# EAGLE design cfide-adapter (EAGLE 7.5.0)
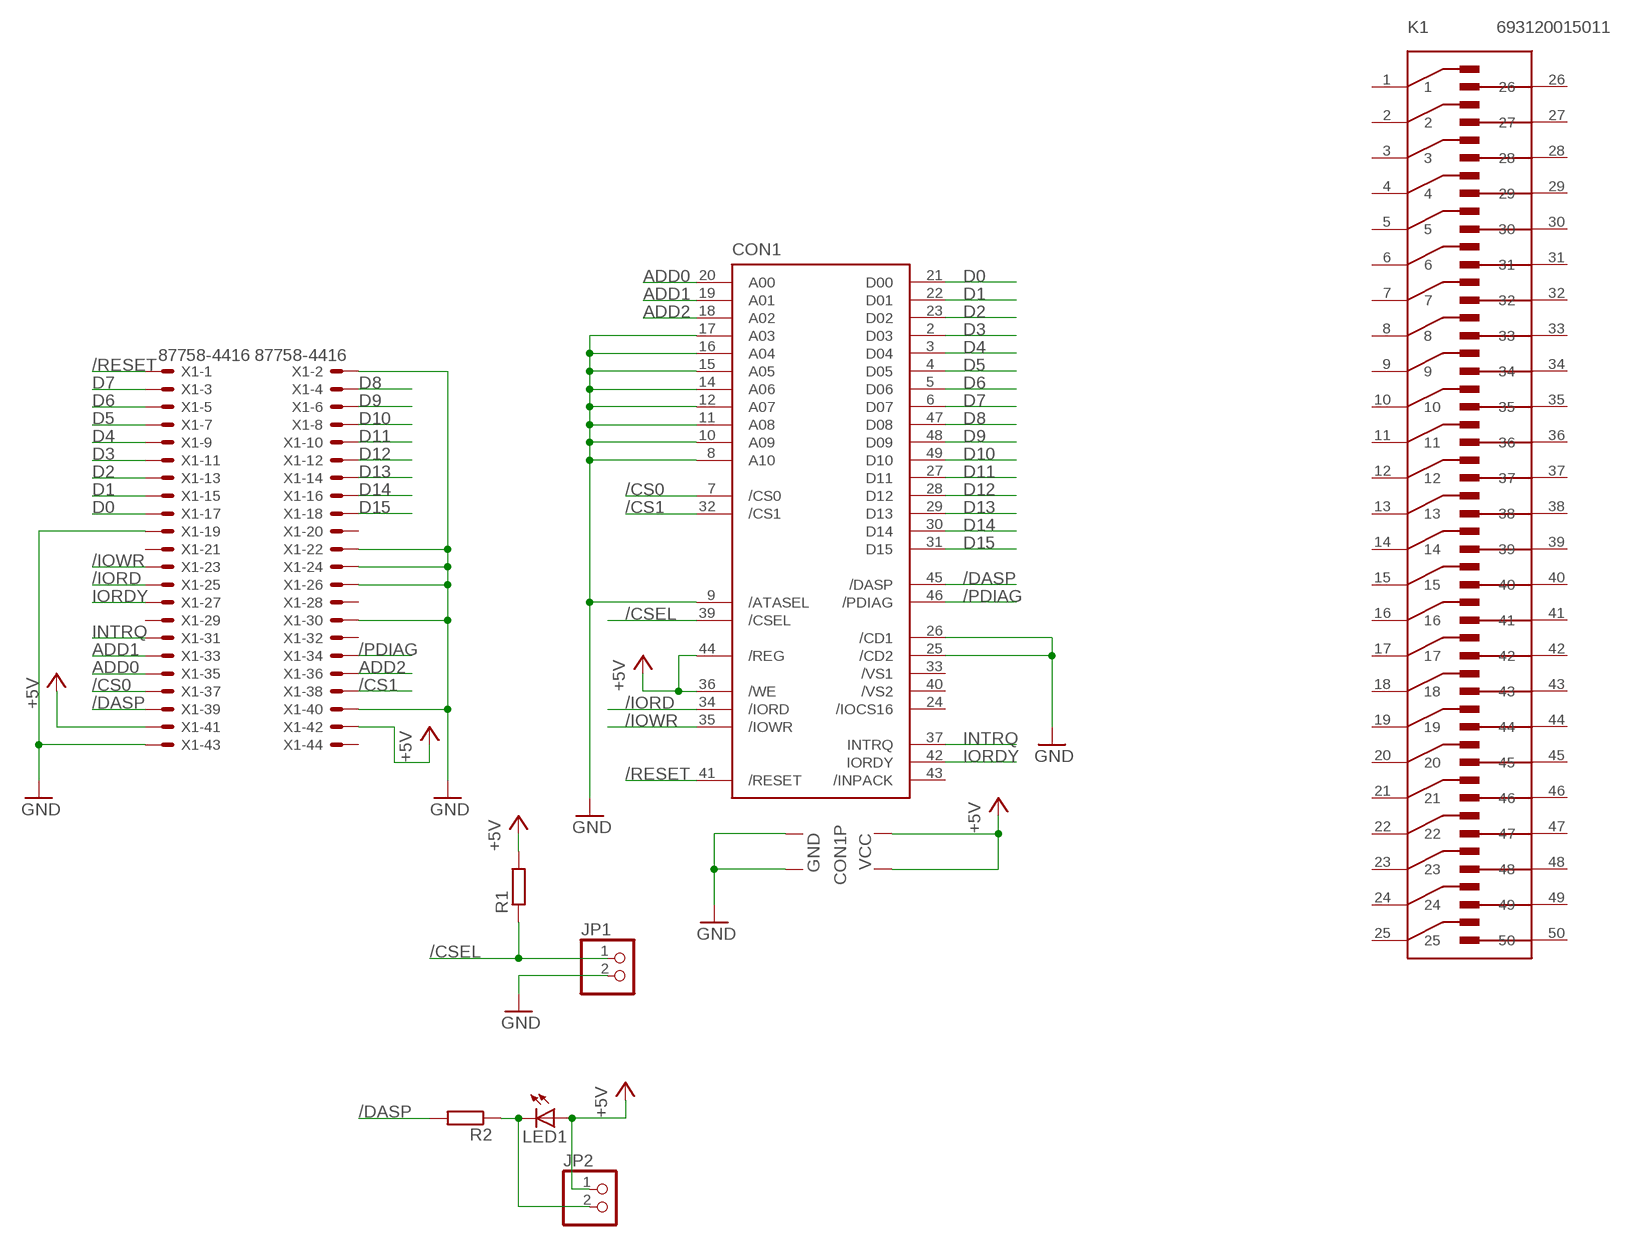
[diagram p0: schematic, sheet 1]

## Parts
CON1  CF-CARD-IDE_MODE  [MI20-50PD-SF]
JP1  HEADER-1X2ROUND  [1X02_ROUND]
JP2  HEADER-1X2ROUND  [1X02_ROUND]
K1  693120015011  [693120015011]
LED1  LEDCHIP-LED0603  [CHIP-LED0603]
R1  R-EU_R0603  [R0603]
R2  R-EU_R0603  [R0603]
X1  87758-4416  [87758-4416]

## Nets
+5V: CON1.13(VCC2) CON1.36(/WE) CON1.38(VCC1) CON1.44(/REG) JP2.1 LED1.A R1.2 X1.41 X1.42
/CS0: CON1.7(/CS0) X1.37
/CS1: CON1.32(/CS1) X1.38
/CSEL: CON1.39(/CSEL) JP1.1 R1.1
/DASP: CON1.45(/DASP) R2.2 X1.39
/IORD: CON1.34(/IORD) X1.25
/IOWR: CON1.35(/IOWR) X1.23
/PDIAG: CON1.46(/PDIAG) X1.34
/RESET: CON1.41(/RESET) X1.1
ADD0: CON1.20(A00) X1.35
ADD1: CON1.19(A01) X1.33
ADD2: CON1.18(A02) X1.36
D0: CON1.21(D00) X1.17
D1: CON1.22(D01) X1.15
D2: CON1.23(D02) X1.13
D3: CON1.2(D03) X1.11
D4: CON1.3(D04) X1.9
D5: CON1.4(D05) X1.7
D6: CON1.5(D06) X1.5
D7: CON1.6(D07) X1.3
D8: CON1.47(D08) X1.4
D9: CON1.48(D09) X1.6
D10: CON1.49(D10) X1.8
D11: CON1.27(D11) X1.10
D12: CON1.28(D12) X1.12
D13: CON1.29(D13) X1.14
D14: CON1.30(D14) X1.16
D15: CON1.31(D15) X1.18
GND: CON1.1(GND1) CON1.8(A10) CON1.9(/ATASEL) CON1.10(A09) CON1.11(A08) CON1.12(A07) CON1.14(A06) CON1.15(A05) CON1.16(A04) CON1.17(A03) CON1.25(/CD2) CON1.26(/CD1) CON1.50(GND2) JP1.2 X1.2 X1.19 X1.22 X1.24 X1.26 X1.30 X1.40 X1.43
INTRQ: CON1.37(INTRQ) X1.31
IORDY: CON1.42(IORDY) X1.27
N$3: JP2.2 LED1.C R2.1
Unconnected: CON1.24(/IOCS16) CON1.33(/VS1) CON1.40(/VS2) CON1.43(/INPACK) K1.1 K1.2 K1.3 K1.4 K1.5 K1.6 K1.7 K1.8 K1.9 K1.10 K1.11 K1.12 K1.13 K1.14 K1.15 K1.16 K1.17 K1.18 K1.19 K1.20 K1.21 K1.22 K1.23 K1.24 K1.25 K1.26 K1.27 K1.28 K1.29 K1.30 K1.31 K1.32 K1.33 K1.34 K1.35 K1.36 K1.37 K1.38 K1.39 K1.40 K1.41 K1.42 K1.43 K1.44 K1.45 K1.46 K1.47 K1.48 K1.49 K1.50 X1.20 X1.21 X1.28 X1.29 X1.32 X1.44

## Library data of the parts
CON1 = con-hirose:CF-CARD-IDE_MODE: Compact Flash Adapter Type I or II without Eject Button Source: con-hirose.lbr from Bob Starr <rtzaudio@mindspring.com>; OC_FARNELL: unknown; OC_NEWARK: unknown
JP1 JP2 = microbuilder:HEADER-1X2: PIN HEADER
K1 = Wuerth_Elektronik_eiCan_Communication_Connectors_v2.2:693120015011: WR-CRD COMPACT FLASH CARD CONNECTOR HEADER 50PINS
LED1 = adafruit:LED: LED OSRAM: - CHIPLED LG R971, LG N971, LY N971, LG Q971, LY Q971, LO R971, LY R971 LH N974, LH R974 LS Q976, LO Q976, LY Q976 LO Q996 - Hyper CHIPLED LW Q18S LB Q993, LB Q99A, LB R99A - SideLED LS A670, LO A670, LY A670, LG A670, LP A670 LB A673, LV A673, LT A673, LW A673 LH A674 LY A675 LS A676, LA A676, LO A676, LY A676, LW A676 LS A679, LY A679, LG A679 - Hyper Micro SIDELED® LS Y876, LA Y876, LO Y876, LY Y876 LT Y87S - SmartLED LW L88C, LW L88S LB L89C, LB L89S, LG L890 LS L89K, LO L89K, LY L89K LS L896, LA L896, LO L896, LY L896 - TOPLED LS T670, LO T670, LY T670, LG T670, LP T670 LSG T670, LSP T670, LSY T670, LOP T670, LYG T670 LG T671, LOG T671, LSG T671 LB T673, LV T673, LT T673, LW T673 LH T674 LS T676, LA T676, LO T676, LY T676, LB T676, LH T676, LSB T676, LW T676 LB T67C, LV T67C, LT T67C, LS T67K, LO T67K, LY T67K, LW E67C LS E67B, LA E67B, LO E67B, LY E67B, LB E67C, LV E67C, LT E67C LW T67C LS T679, LY T679, LG T679 LS T770, LO T770, LY T770, LG T770, LP T770 LB T773, LV T773, LT T773, LW T773 LH T774 LS E675, LA E675, LY E675, LS T675 LS T776, LA T776, LO T776, LY T776, LB T776 LHGB T686 LT T68C, LB T68C - Hyper Mini TOPLED® LB M676 - Mini TOPLED Santana® LG M470 LS M47K, LO M47K, LY M47K Source: http://www.osram.convergy.de/
R1 R2 = resistor:R-EU_: RESISTOR, European symbol
X1 = con-molex:87758-4416: 44 Pin - 2mm Dual Row Single Wafer, Vertical T/H HDR Source: http://www.molex.com/pdm_docs/sd/877580616_sd.pdf; MF: MOLEX; MPN: 87758-4416; OC_FARNELL: unknown; OC_NEWARK: 59J1588

## Board
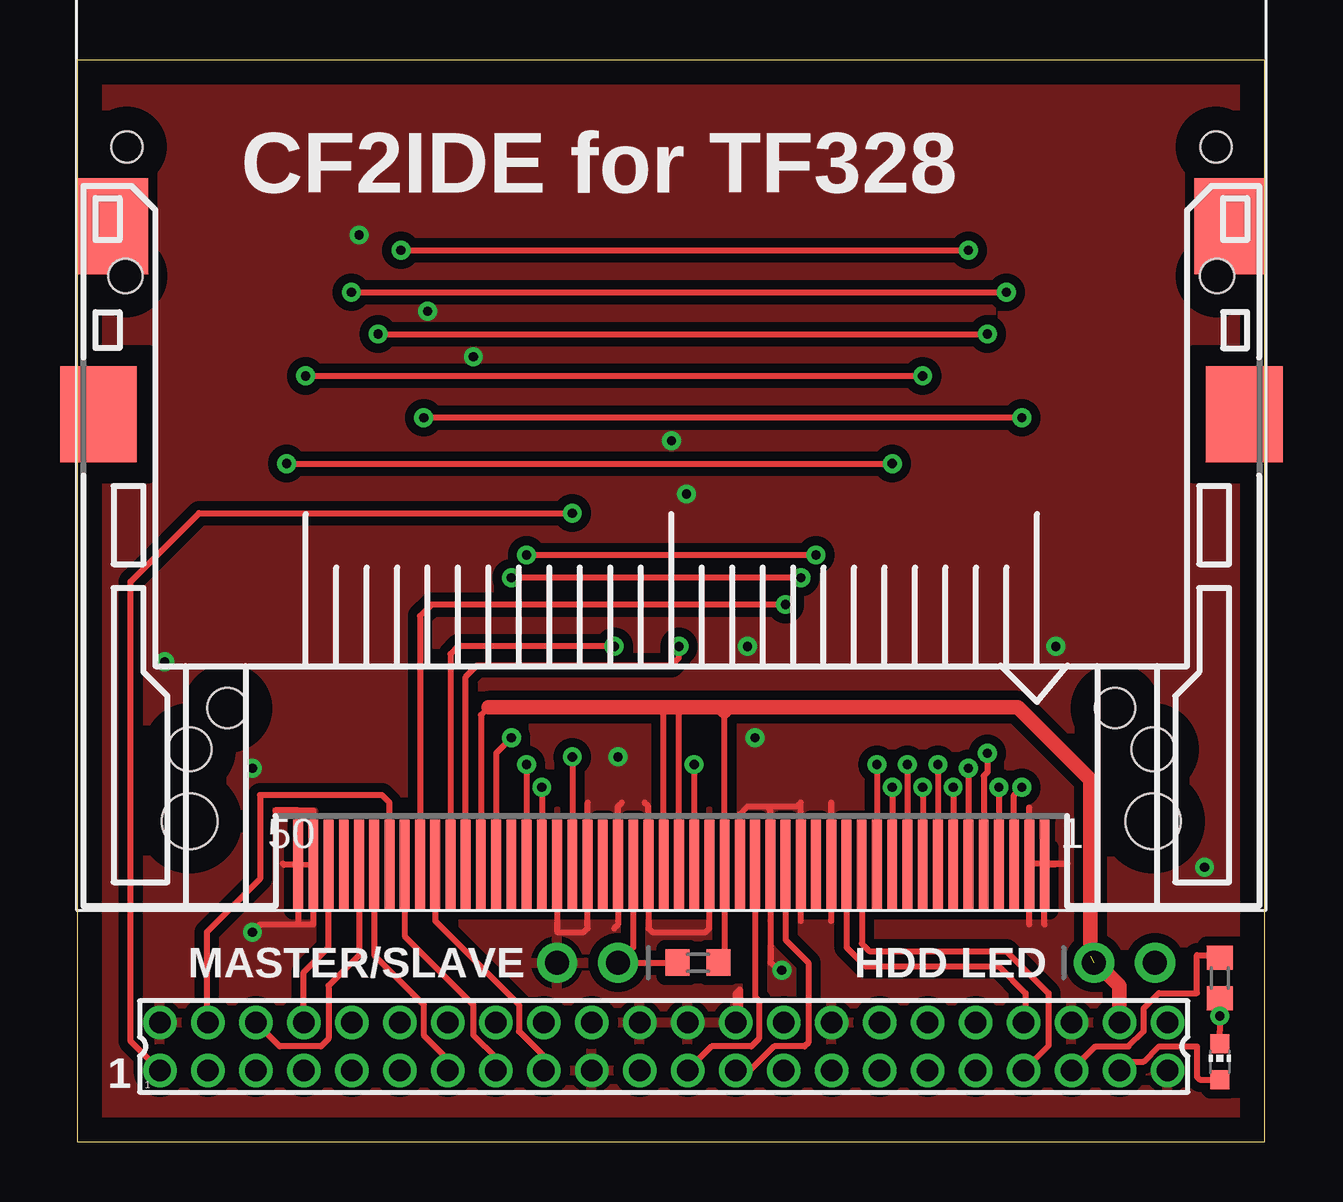
[diagram p1: board, top side]
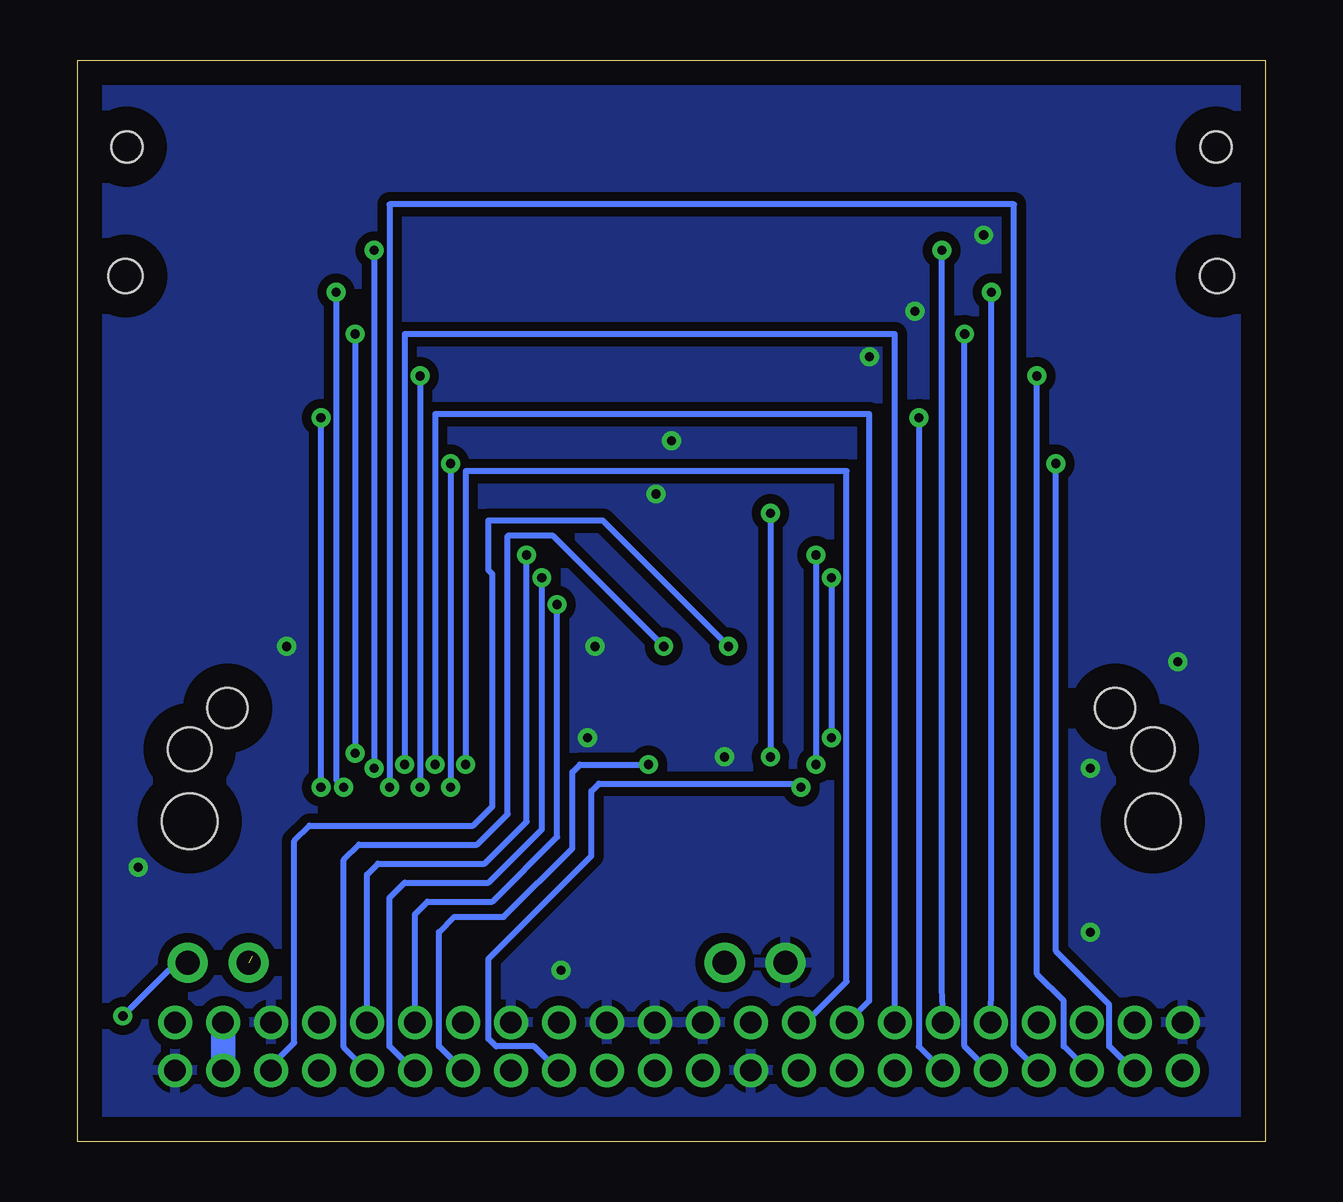
[diagram p2: board, bottom side, seen from below]

Size 49.51 x 45.07 mm. Coordinates in mm from the lower left corner, seen from the top.
Outline: 0,0 49.51,0 49.51,45.07 0,45.07 0,0
Copper layers (1*16): Top 0.035mm / dielectric 1.5mm / Bottom 0.035mm
Design rules "default": minimum track width 10mil, minimum drill 24mil, track to track 8mil, track to pad 8mil, pad to pad 8mil, via to via 8mil, smd to smd 8mil, copper to edge 40mil, drill to drill 8mil, minimum pad ring 10mil, minimum via ring 8mil, stop-mask expansion 4mil, vias tented up to drill 0mil, thermal gap 10mil

### Footprints (pad centres in the part's own frame; a part is rotated, then mirrored left to right if it is on the bottom)
MI20-50PD-SF = smd 0.41 x 3.75: 1 15.557,-18.78; 2 14.287,-18.78; 3 13.018,-18.78; 4 11.748,-18.78; 5 10.477,-18.78; 6 9.207,-18.78; 7 7.938,-18.78; 8 6.668,-18.78; 9 5.397,-18.78; 10 4.128,-18.78; 11 2.857,-18.78; 12 1.587,-18.78; 13 0.318,-18.78; 14 -0.953,-18.78; 15 -2.223,-18.78; 16 -3.493,-18.78; 17 -4.763,-18.78; 18 -6.032,-18.78; 19 -7.303,-18.78; 20 -8.572,-18.78; 21 -9.842,-18.78; 22 -11.113,-18.78; 23 -12.383,-18.78; 24 -13.652,-18.78; 25 -14.922,-18.78; 26 14.922,-18.78; 27 13.652,-18.78; 28 12.383,-18.78; 29 11.113,-18.78; 30 9.842,-18.78; 31 8.572,-18.78; 32 7.303,-18.78; 33 6.032,-18.78; 34 4.763,-18.78; 35 3.493,-18.78; 36 2.223,-18.78; 37 0.953,-18.78; 38 -0.318,-18.78; 39 -1.587,-18.78; 40 -2.857,-18.78; 41 -4.128,-18.78; 42 -5.397,-18.78; 43 -6.668,-18.78; 44 -7.938,-18.78; 45 -9.207,-18.78; 46 -10.477,-18.78; 47 -11.748,-18.78; 48 -13.018,-18.78; 49 -14.287,-18.78; 50 -15.557,-18.78 | smd 3.2 x 4: M1 -23.883,-0.005; M2 23.883,-0.005 | hole 1.676: 18.5,-12.25; -18.5,-12.25 | hole 1.422: -22.75,5.75; 22.75,5.75
1X02_ROUND = drill 1 pad 1.676: 1 -1.27,0; 2 1.27,0
693120015011 = smd 0.4 x 2.6: 1 15.875,0; 2 14.605,0; 3 13.335,0; 4 12.065,0; 5 10.795,0; 6 9.525,0; 7 8.255,0; 8 6.985,0; 9 5.715,0; 10 4.445,0; 11 3.175,0; 12 1.905,0; 13 0.635,0; 14 -0.635,0; 15 -1.905,0; 16 -3.175,0; 17 -4.445,0; 18 -5.715,0; 19 -6.985,0; 20 -8.255,0; 21 -9.525,0; 22 -10.795,0; 23 -12.065,0; 24 -13.335,0; 25 -14.605,0; 26 15.24,0; 27 13.97,0; 28 12.7,0; 29 11.43,0; 30 10.16,0; 31 8.89,0; 32 7.62,0; 33 6.35,0; 34 5.08,0; 35 3.81,0; 36 2.54,0; 37 1.27,0; 38 0,0; 39 -1.27,0; 40 -2.54,0; 41 -3.81,0; 42 -5.08,0; 43 -6.35,0; 44 -7.62,0; 45 -8.89,0; 46 -10.16,0; 47 -11.43,0; 48 -12.7,0; 49 -13.97,0; 50 -15.24,0 | smd 3 x 4: P$1 -22.98,27.2; P$2 23.615,27.2 | hole 2.3: -19.76,2.4; 20.395,2.4 | hole 1.8: -19.76,5.4; 20.395,5.4 | hole 1.3: -22.38,30.5; 23.015,30.5
CHIP-LED0603 = smd 0.8 x 0.8: A 0,-0.75; C 0,0.75
R0603 = smd 1 x 1.1: 1 -0.85,0; 2 0.85,0
87758-4416 = drill 0.9 pad 1.27: 1 -21,-1; 2 -21,1; 3 -19,-1; 4 -19,1; 5 -17,-1; 6 -17,1; 7 -15,-1; 8 -15,1; 9 -13,-1; 10 -13,1; 11 -11,-1; 12 -11,1; 13 -9,-1; 14 -9,1; 15 -7,-1; 16 -7,1; 17 -5,-1; 18 -5,1; 19 -3,-1; 20 -3,1; 21 -1,-1; 22 -1,1; 23 1,-1; 24 1,1; 25 3,-1; 26 3,1; 27 5,-1; 28 5,1; 29 7,-1; 30 7,1; 31 9,-1; 32 9,1; 33 11,-1; 34 11,1; 35 13,-1; 36 13,1; 37 15,-1; 38 15,1; 39 17,-1; 40 17,1; 41 19,-1; 42 19,1; 43 21,-1; 44 21,1

### Placement (x,y rotation side)
CON1  24.77,30.32 0 top
JP1  21.27,7.46 180 top
JP2  43.66,7.46 0 top
K1  24.45,10.95 0 top
LED1  47.62,3.33 0 top
R1  25.88,7.46 0 top
R2  47.62,6.83 90 top
X1  24.45,3.97 0 top

### Tracks (layer width: path | path; a pad name or v marks a point on that pad's centre or on a via)
+5V  (1 unrouted)
  Top 0.254: LED1.A 46.79,2.58 46.67,2.7 46.67,3.97 45.08,3.97 44.45,3.33 43.81,3.33 X1.41 | R1.2 26.99,7.56 CON1.36 26.99,17.94 27.15,18.1 | 17.14,18.1 16.83,17.78 CON1.44 | CON1.38 24.45,17.94 24.29,18.1 | CON1.13 25.08,18.1
  Top 0.61: X1.42 43.45,6.51 42.23,7.73 42.23,15.08 39.21,18.1 26.83,18.1 | 17.14,18.1 24.29,18.1 25.08,18.1 26.83,18.1 | 26.99,17.94 26.83,18.1
  Bottom 1.016: X1.42 X1.41
/CS0
  Top 0.254: CON1.7 32.7,8.25 33.02,7.94 38.73,7.94 40.48,6.19 40.48,4 X1.37
/CS1
  Top 0.254: CON1.32 32.07,8.1 32.86,7.3 38.42,7.3 39.53,6.19 39.53,5.05 X1.38
/CSEL
  Top 0.254: CON1.39 23.18,8.1 JP1.1 R1.1
/DASP  (via drill 0.38)
  Top 0.254: X1.39 42.45,3.97 43.81,3.97 44.45,4.6 44.45,5.56 45.08,6.19 46.67,6.19 46.67,7.78 47.52,7.78 R2.2 | v22.38,20.64 15.88,20.64 15.56,20.32 CON1.45
  Bottom 0.254: X1.39 41.45,3.16 40.48,4.13 40.48,12.54 39.85,13.18 33.02,13.18 32.23,13.97 32.23,23.65 32.38,23.81 32.38,25.88 27.62,25.88 v22.38,20.64
/IORD
  Top 0.254: CON1.34 29.53,8.41 30.48,7.46 30.48,4.13 30.32,3.97 29.05,3.97 28.05,2.97 X1.25
/IOWR
  Top 0.254: CON1.35 28.26,6.03 28.42,5.87 28.42,4.29 28.1,3.97 26.45,3.97 X1.23
/PDIAG  (via drill 0.38)
  Top 0.254: v29.53,22.38 14.76,22.38 14.29,21.91 CON1.46
  Bottom 0.254: X1.34 35.45,9.48 34.92,10 32.23,10 29.53,12.7 v29.53,22.38
/RESET  (via drill 0.38)
  Top 0.254: v20.64,26.19 5.08,26.19 2.22,23.34 2.22,4.19 X1.1 | v20.64,16.03 CON1.41
  Bottom 0.254: v20.64,26.19 v20.64,16.03
ADD0  (via drill 0.38)
  Top 0.254: CON1.20 16.19,19.37 16.67,19.84 24.77,19.84 25.08,20.16 v25.08,20.64
  Bottom 0.254: X1.35 38.42,3.94 38.42,11.75 37.78,12.38 32.86,12.38 31.59,13.65 31.59,25.24 29.69,25.24 v25.08,20.64
ADD1  (via drill 0.38)
  Top 0.254: v30.16,23.49 v18.1,23.49 | v18.1,16.83 17.46,16.19 CON1.19
  Bottom 0.254: X1.33 35.51,2.97 36.51,3.97 36.51,10.16 35.88,10.79 32.38,10.79 30.16,13.02 v30.16,23.49 | v18.1,23.49 v18.1,16.83
ADD2  (via drill 0.38)
  Top 0.254: v30.8,24.45 v18.73,24.45 | v18.73,15.72 CON1.18
  Bottom 0.254: X1.36 37.45,11.13 36.99,11.59 32.54,11.59 30.8,13.33 v30.8,24.45 | v18.73,24.45 v18.73,15.72
D0
  Top 0.254: CON1.21 14.92,9.21 18.41,5.71 18.41,4.6 19.53,3.49 19.53,3.05 X1.17
D1
  Top 0.254: CON1.22 13.65,8.57 16.51,5.71 16.51,4.44 17.46,3.49 17.46,2.98 X1.15
D2
  Top 0.254: CON1.23 12.38,7.78 14.45,5.71 14.45,4.44 15.45,3.44 X1.13
D3  (via drill 0.38)
  Top 0.254: CON1.2 39.05,14.45 v39.37,14.76 | v39.37,30.16 v14.45,30.16
  Bottom 0.254: v39.37,14.76 v39.37,30.16 | v14.45,30.16 14.45,3.97 X1.11
D4  (via drill 0.38)
  Top 0.254: v12.54,33.65 v37.94,33.65 | v37.94,16.19 37.94,15.4 37.78,15.24 CON1.3
  Bottom 0.254: X1.9 11.54,2.97 12.54,3.97 v12.54,33.65 | v37.94,33.65 v37.94,16.19
D5  (via drill 0.38)
  Top 0.254: v36.51,14.76 CON1.4
  Bottom 0.254: X1.7 9.48,2.97 10.48,3.97 10.48,39.05 36.51,39.05 v36.51,14.76
D6  (via drill 0.38)
  Top 0.254: v9.53,31.91 v35.24,31.91 | v35.24,14.76 CON1.5
  Bottom 0.254: X1.5 7.45,3 8.41,3.97 8.41,5.87 9.53,6.98 v9.53,31.91 | v35.24,31.91 v35.24,14.76
D7  (via drill 0.38)
  Top 0.254: v8.73,28.26 v33.97,28.26 | v33.97,14.76 CON1.6
  Bottom 0.254: X1.3 5.51,2.97 6.51,3.97 6.51,5.71 8.73,7.94 v8.73,28.26 | v33.97,28.26 v33.97,14.76
D8
  Top 0.254: CON1.47 13.02,14.13 12.7,14.45 7.62,14.45 7.62,10.95 5.4,8.73 5.4,5.02 X1.4
D9
  Top 0.254: CON1.48 11.75,7.78 10.48,6.51 10.48,4.29 10.16,3.97 8.45,3.97 X1.6
D10
  Top 0.254: X1.8 9.45,7.07 10.48,8.1 CON1.49
D11  (via drill 0.38)
  Top 0.254: v11.43,35.4 v38.73,35.4 | v38.42,14.76 CON1.27
  Bottom 0.254: X1.10 11.45,5.54 11.43,6.19 v11.43,35.4 | v38.73,35.4 38.73,15.08 v38.42,14.76
D12  (via drill 0.38)
  Top 0.254: v13.49,37.15 v37.15,37.15 | v37.15,15.56 CON1.28
  Bottom 0.254: X1.12 13.45,5.6 13.49,6.35 v13.49,37.15 | v37.15,37.15 v37.15,15.56
D13  (via drill 0.38)
  Top 0.254: v35.88,15.72 CON1.29
  Bottom 0.254: X1.14 15.45,33.65 35.88,33.65 v35.88,15.72
D14  (via drill 0.38)
  Top 0.254: v34.61,15.72 CON1.30
  Bottom 0.254: X1.16 17.41,4.97 16.51,5.87 16.51,30.32 34.61,30.32 v34.61,15.72
D15  (via drill 0.38)
  Top 0.254: v33.34,15.72 CON1.31
  Bottom 0.254: X1.18 19.16,4.97 17.46,6.67 17.46,27.94 33.34,27.94 v33.34,15.72
GND  (via drill 0.38)
  Top 0.254: 21.27,14.13 CON1.16 21.27,8.89 21.11,8.73 20,8.73 CON1.17 | 22.7,14.13 22.54,13.97 CON1.15 22.54,9.05 22.38,8.89 | 23.65,14.13 23.81,13.97 CON1.14 23.81,8.89 23.97,8.73 26.19,8.73 26.35,8.89 CON1.12 | 31.43,14.13 CON1.8 31.43,9.21 | 30.16,9.21 CON1.9 30.16,14.13 30,13.97 28.73,13.97 | 39.69,9.05 CON1.26 | CON1.26 39.69,13.92 | CON1.11 27.62,13.65 27.94,13.97 28.73,13.97 | CON1.10 28.89,13.81 28.73,13.97 | 28.89,11.27 28.89,7.46 v29.37,7.14 | CON1.50 9.21,13.81 | 9.21,13.81 8.26,13.81 | 9.21,13.81 9.84,13.81 CON1.25 | CON1.25 9.84,9.05 9.21,9.05 | 9.21,9.05 7.62,9.05 v7.3,8.73 | CON1.50 8.62,11.54 8.57,11.59 CON1.25 | CON1.50 9.21,9.05 | CON1.1 41.27,11.59 40.32,11.59 | 40.32,9.05 40.32,11.59 | 40.32,11.59 39.69,11.59 CON1.26 | 27.62,6.35 27.62,5.08 27.46,4.92 27.46,6.19 27.62,6.35
  other vias: 7.3,15.56 22.54,16.03 28.26,16.83 27.94,20.64 40.8,20.64 46.99,11.43 3.65,20 25.4,26.99 24.77,29.21 11.75,37.78 16.51,32.7 14.61,34.61
  pour Top (isolate 0.381): 0,45.09 49.69,45.09 49.69,0 0,0
  pour Bottom (isolate 0.381): 0,45.09 49.69,45.09 49.69,0 0,0
INTRQ  (via drill 0.38)
  Top 0.254: v25.72,15.72 CON1.37
  Bottom 0.254: X1.31 34.45,3.97 34.45,8.73 33.81,9.37 31.75,9.37 28.89,12.22 28.89,15.4 28.57,15.72 v25.72,15.72
IORDY  (via drill 0.38)
  Top 0.254: v19.37,14.76 CON1.42
  Bottom 0.254: X1.27 29.48,2.97 30.48,3.97 32.07,3.97 32.38,4.29 32.38,7.62 28.1,11.91 28.1,14.6 27.78,14.92 19.53,14.92 v19.37,14.76
N$3  (via drill 0.38)
  Top 0.254: LED1.C 47.62,4.6 v47.62,5.24 R2.1
  Bottom 0.254: JP2.2 45.4,7.46 v47.62,5.24

### Text on the board
tNames: CF2IDE for TF328 | MASTER/SLAVE | HDD LED | 1